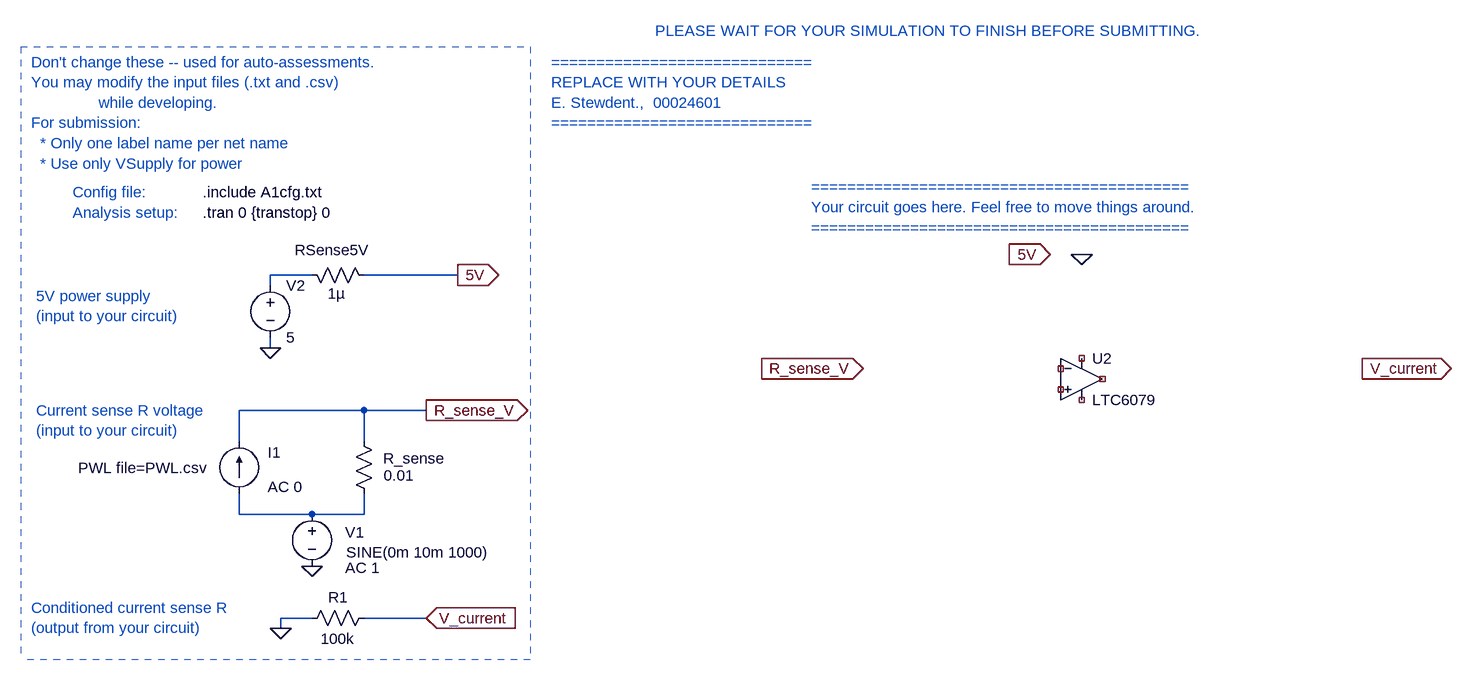
[diagram p0: schematic E344_Ass1_CurrSense.asc]
E344_Ass1_CurrSense.asc, the LTspice schematic file:
Version 4
SHEET 1 3140 2124
WIRE -1920 -1072 -1984 -1072
WIRE -1696 -1072 -1840 -1072
WIRE -1984 -1056 -1984 -1072
WIRE -1984 -960 -1984 -976
WIRE -1840 -864 -2032 -864
WIRE -1744 -864 -1840 -864
WIRE -2032 -816 -2032 -864
WIRE -1840 -816 -1840 -864
WIRE -2032 -704 -2032 -736
WIRE -1920 -704 -2032 -704
WIRE -1840 -704 -1840 -736
WIRE -1840 -704 -1920 -704
WIRE -1920 -544 -1968 -544
WIRE -1744 -544 -1840 -544
WIRE -1968 -528 -1968 -544
FLAG -1696 -1072 5V
IOPIN -1696 -1072 Out
FLAG -1984 -960 0
FLAG -784 -1104 5V
IOPIN -784 -1104 In
FLAG -1744 -864 R_sense_V
IOPIN -1744 -864 Out
FLAG -1920 -624 0
FLAG -304 -928 V_current
IOPIN -304 -928 Out
FLAG -1072 -928 R_sense_V
IOPIN -1072 -928 In
FLAG -1744 -544 V_current
IOPIN -1744 -544 In
FLAG -1968 -528 0
FLAG -736 -1104 0
SYMBOL voltage -1984 -1072 R0
WINDOW 123 0 0 Left 0
WINDOW 39 0 0 Left 0
SYMATTR InstName V2
SYMATTR Value 5
SYMBOL res -1936 -1088 M90
WINDOW 0 -7 47 VBottom 2
WINDOW 3 29 54 VTop 2
SYMATTR InstName RSense5V
SYMATTR Value 1µ
SYMBOL res -1824 -720 R180
WINDOW 0 -109 70 Left 2
WINDOW 3 -62 44 Left 2
SYMATTR InstName R_sense
SYMATTR Value 0.01
SYMBOL current -2032 -736 R180
WINDOW 0 -64 63 Left 2
WINDOW 3 248 39 Right 2
WINDOW 123 -97 10 Left 2
WINDOW 39 0 0 Left 0
SYMATTR InstName I1
SYMATTR Value PWL file=PWL.csv
SYMATTR Value2 AC 0
SYMBOL voltage -1920 -720 R0
WINDOW 0 66 60 Bottom 2
WINDOW 3 163 59 Top 2
WINDOW 123 78 114 Bottom 2
WINDOW 39 0 0 Left 0
SYMATTR InstName V1
SYMATTR Value SINE(0m 10m 1000)
SYMATTR Value2 AC 1
SYMBOL res -1824 -560 R90
WINDOW 0 0 56 VBottom 2
WINDOW 3 32 56 VTop 2
SYMATTR InstName R1
SYMATTR Value 100k
SYMBOL OpAmps\\LTC6079 -736 -912 R0
SYMATTR InstName U2
TEXT -2088 -1168 Left 2 !.tran 0 {transtop} 0
TEXT -2088 -1200 Left 2 !.include A1cfg.txt
TEXT -2352 -1400 Left 2 ;Don't change these -- used for auto-assessments.\nYou may modify the input files (.txt and .csv) \n               while developing.\nFor submission: \n  * Only one label name per net name\n  * Use only VSupply for power
TEXT -2288 -1200 Left 2 ;Config file:
TEXT -2288 -1168 Left 2 ;Analysis setup:
TEXT -1552 -1400 Left 2 ;=============================\nREPLACE WITH YOUR DETAILS\nE. Stewdent.,  00024601\n=============================
TEXT -1152 -1208 Left 2 ;==========================================\nYour circuit goes here. Feel free to move things around. \n==========================================
TEXT -1392 -1448 Left 2 ;PLEASE WAIT FOR YOUR SIMULATION TO FINISH BEFORE SUBMITTING.
TEXT -2344 -1040 Left 2 ;5V power supply\n(input to your circuit)
TEXT -2344 -864 Left 2 ;Current sense R voltage\n(input to your circuit)
TEXT -2352 -560 Left 2 ;Conditioned current sense R\n(output from your circuit)
LINE Normal -1584 -1424 -1584 -480 2
LINE Normal -2368 -1424 -1584 -1424 2
LINE Normal -1584 -480 -2368 -480 2
LINE Normal -1584 -496 -1584 -496 2
LINE Normal -2368 -1424 -2368 -480 2

The netlist it stands for:
* E344_Ass1_CurrSense.asc
V2 N001 0 5
RSense5V N001 5V 1µ
R_sense N002 R_sense_V 0.01
I1 N002 R_sense_V PWL file=PWL.csv AC 0
V1 N002 0 SINE(0m 10m 1000) AC 1
R1 V_current 0 100k
XU2 NC_01 NC_02 NC_03 NC_04 NC_05 LTC6078  ; LTC6079, pins In+ In- V+ V- OUT
.tran 0 {transtop} 0
.include A1cfg.txt
* Don't change these -- used for auto-assessments.
* You may modify the input files (.txt and .csv)
*                while developing.
* For submission:
*   * Only one label name per net name
*   * Use only VSupply for power
* Config file:
* Analysis setup:
* =============================
* REPLACE WITH YOUR DETAILS
* E. Stewdent.,  00024601
* =============================
* ==========================================
* Your circuit goes here. Feel free to move things around.
* ==========================================
* PLEASE WAIT FOR YOUR SIMULATION TO FINISH BEFORE SUBMITTING.
* 5V power supply
* (input to your circuit)
* Current sense R voltage
* (input to your circuit)
* Conditioned current sense R
* (output from your circuit)
.lib LTC5.lib
.backanno
.end